# Altium project NumPadAltium.PrjPcb
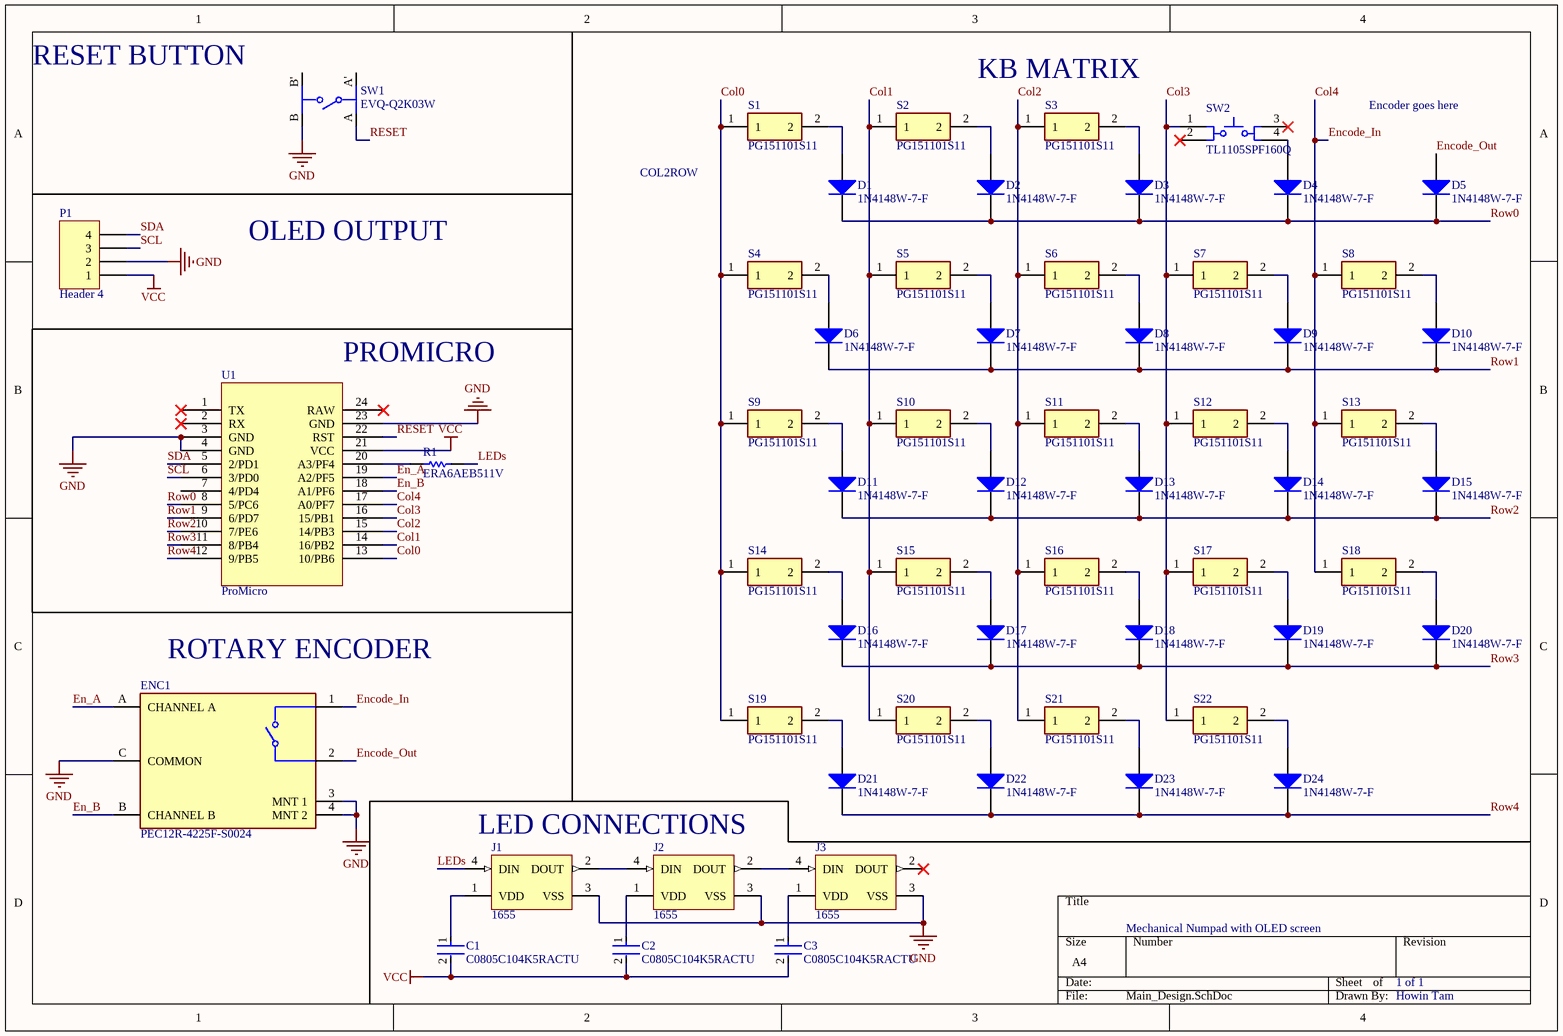
[diagram p0: Main_Design.SchDoc]
1 sheet, 58 parts. Net scope: global (net labels, ports and power ports of the same name join across sheets).
Board file: NumPadPCB.PcbDoc

## Sheet Main_Design.SchDoc
size A4; SheetNumber: 1; SheetTotal: 1

### Parts
C1  C0805C104K5RACTU  [FP-C0805C-DN-MFG]
C2  C0805C104K5RACTU  [FP-C0805C-DN-MFG]
C3  C0805C104K5RACTU  [FP-C0805C-DN-MFG]
D1  1N4148W-7-F  [DIOD-SOD123-2_V]
D2  1N4148W-7-F  [DIOD-SOD123-2_V]
D3  1N4148W-7-F  [DIOD-SOD123-2_V]
D4  1N4148W-7-F  [DIOD-SOD123-2_V]
D5  1N4148W-7-F  [DIOD-SOD123-2_V]
D6  1N4148W-7-F  [DIOD-SOD123-2_V]
D7  1N4148W-7-F  [DIOD-SOD123-2_V]
D8  1N4148W-7-F  [DIOD-SOD123-2_V]
D9  1N4148W-7-F  [DIOD-SOD123-2_V]
D10  1N4148W-7-F  [DIOD-SOD123-2_V]
D11  1N4148W-7-F  [DIOD-SOD123-2_V]
D12  1N4148W-7-F  [DIOD-SOD123-2_V]
D13  1N4148W-7-F  [DIOD-SOD123-2_V]
D14  1N4148W-7-F  [DIOD-SOD123-2_V]
D15  1N4148W-7-F  [DIOD-SOD123-2_V]
D16  1N4148W-7-F  [DIOD-SOD123-2_V]
D17  1N4148W-7-F  [DIOD-SOD123-2_V]
D18  1N4148W-7-F  [DIOD-SOD123-2_V]
D19  1N4148W-7-F  [DIOD-SOD123-2_V]
D20  1N4148W-7-F  [DIOD-SOD123-2_V]
D21  1N4148W-7-F  [DIOD-SOD123-2_V]
D22  1N4148W-7-F  [DIOD-SOD123-2_V]
D23  1N4148W-7-F  [DIOD-SOD123-2_V]
D24  1N4148W-7-F  [DIOD-SOD123-2_V]
ENC1  PEC12R-4225F-S0024  [FP-PEC12R-4225F-S0024-MFG]
J1  1655  [ADA-RGB-1655_V]
J2  1655  [ADA-RGB-1655_V]
J3  1655  [ADA-RGB-1655_V]
P1  Header 4  [HDR1X4]
R1  ERA6AEB511V  [RESC2013X60X40ML20T25]
S1  PG151101S11  [SW_PG151101S11]
S2  PG151101S11  [SW_PG151101S11]
S3  PG151101S11  [SW_PG151101S11]
S4  PG151101S11  [SW_PG151101S11]
S5  PG151101S11  [SW_PG151101S11]
S6  PG151101S11  [SW_PG151101S11]
S7  PG151101S11  [SW_PG151101S11]
S8  PG151101S11  [SW_PG151101S11]
S9  PG151101S11  [SW_PG151101S11]
S10  PG151101S11  [SW_PG151101S11]
S11  PG151101S11  [SW_PG151101S11]
S12  PG151101S11  [SW_PG151101S11]
S13  PG151101S11  [SW_PG151101S11]
S14  PG151101S11  [SW_PG151101S11]
S15  PG151101S11  [SW_PG151101S11]
S16  PG151101S11  [SW_PG151101S11]
S17  PG151101S11  [SW_PG151101S11]
S18  PG151101S11  [SW_PG151101S11]
S19  PG151101S11  [SW_PG151101S11]
S20  PG151101S11  [SW_PG151101S11]
S21  PG151101S11  [SW_PG151101S11]
S22  PG151101S11  [SW_PG151101S11]
SW1  EVQ-Q2K03W  [FP-EVQ-Q2K03W-MFG]
SW2  TL1105SPF160Q  [ESWI-TL1105SPF_V]
U1  ProMicro  [PCBComponent_1]

### Nets
GND: ENC1.3(MNT_1) ENC1.4(MNT_2) ENC1.C(COMMON) J1.3(VSS) J2.3(VSS) J3.3(VSS) P1.2 SW1.B U1.3(GND) U1.4(GND) U1.23(GND)
VCC: C1.2 C2.2 C3.2 P1.1 U1.21(VCC)
Col0: S1.1 S4.1 S9.1 S14.1 S19.1 U1.13(10/PB6)
Col1: S2.1 S5.1 S10.1 S15.1 S20.1 U1.14(16/PB2)
Col2: S3.1 S6.1 S11.1 S16.1 S21.1 U1.15(14/PB3)
Col3: S7.1 S12.1 S17.1 S22.1 SW2.1 U1.16(15/PB1)
Col4: ENC1.1 S8.1 S13.1 S18.1 U1.17(A0/PF7)  [also labelled Encode_In]
En_A: ENC1.A(CHANNEL_A) U1.19(A2/PF5)
En_B: ENC1.B(CHANNEL_B) U1.18(A1/PF6)
Encode_Out: D5.1(A) ENC1.2
LEDs: J1.4(DIN) R1.2
RESET: SW1.A U1.22(RST)
Row0: D1.2(K) D2.2(K) D3.2(K) D4.2(K) D5.2(K) U1.8(5/PC6)
Row1: D6.2(K) D7.2(K) D8.2(K) D9.2(K) D10.2(K) U1.9(6/PD7)
Row2: D11.2(K) D12.2(K) D13.2(K) D14.2(K) D15.2(K) U1.10(7/PE6)
Row3: D16.2(K) D17.2(K) D18.2(K) D19.2(K) D20.2(K) U1.11(8/PB4)
Row4: D21.2(K) D22.2(K) D23.2(K) D24.2(K) U1.12(9/PB5)
SCL: P1.3 U1.6(3/PD0)
SDA: P1.4 U1.5(2/PD1)
NetC1_1: C1.1 J1.1(VDD)
NetC2_1: C2.1 J2.1(VDD)
NetC3_1: C3.1 J3.1(VDD)
NetD1_1: D1.1(A) S1.2
NetD2_1: D2.1(A) S2.2
NetD3_1: D3.1(A) S3.2
NetD4_1: D4.1(A) SW2.4
NetD6_1: D6.1(A) S4.2
NetD7_1: D7.1(A) S5.2
NetD8_1: D8.1(A) S6.2
NetD9_1: D9.1(A) S7.2
NetD10_1: D10.1(A) S8.2
NetD11_1: D11.1(A) S9.2
NetD12_1: D12.1(A) S10.2
NetD13_1: D13.1(A) S11.2
NetD14_1: D14.1(A) S12.2
NetD15_1: D15.1(A) S13.2
NetD16_1: D16.1(A) S14.2
NetD17_1: D17.1(A) S15.2
NetD18_1: D18.1(A) S16.2
NetD19_1: D19.1(A) S17.2
NetD20_1: D20.1(A) S18.2
NetD21_1: D21.1(A) S19.2
NetD22_1: D22.1(A) S20.2
NetD23_1: D23.1(A) S21.2
NetD24_1: D24.1(A) S22.2
NetJ1_2: J1.2(DOUT) J2.4(DIN)
NetJ2_2: J2.2(DOUT) J3.4(DIN)
NetR1_1: R1.1 U1.20(A3/PF4)

Not connected (* = marked no-connect by the designer): J3 2(DOUT)*; SW1 A' B'; SW2 2* 3*; U1 1(TX)* 2(RX)* 7(4/PD4) 24(RAW)*

### Notes on the sheet
- RESET BUTTON
- KB MATRIX
- Encoder goes here
- COL2ROW
- OLED OUTPUT
- (near U1) PROMICRO
- (near ENC1) ROTARY ENCODER
- LED CONNECTIONS
- Mechanical Numpad with OLED screen
- 1 of 1
- Howin Tam

### Library data of the parts
C1-C3 = CMP-2007-00279-2: CAP CER 0.1UF 50V X7R 0805; Manufacturer: KEMET; Value: 0.10 μF; Tolerance: 0.1; Temperature Coefficient: 30ppm/°C; Material: Ceramic; Manufacturer Part Number: C0805C104K5RACTU; Device Class L2: Capacitors; Temperature Range Low: -55°C; Voltage Rating: 50 V; Digikey Description: CAP CER 0.1UF 50V X7R 0805; Category: Cap; ComponentLink2Description: Datasheet; Octopart: https://octopart.com/c0805c104k5ractu-kemet-143926; RoHS: TRUE; ComponentLink2URL: https://content.kemet.com/datasheets/KEM_C1003_C0G_SMD.pdf; Temperature Characteristic: X7R; Temperature: -55°C to +125°C; Height: 0.88mm; Temperature Range High: +125°C; Device Class L1: Passive Components; Automotive: No; Lead Free: Yes; Ipc Land Pattern Name: CAPC200125X78; Device Class L3: Ceramic Capacitors; Mouser Description: Cap Ceramic 0.1uF 50V X7R 10% SMD 2.0 x 1.2 mm 125 C Paper T/R; Capacitance: 0.10 μF; Package: C0805C-DN
D1-D24 = CMP-2000-04932-2: Fast Switching Diode, 100 V, 0.15 A, -65 to 150 degC, 2-Pin?SOD123, RoHS, Tape and Reel; Recovery Time: 4ns; Brand: DiodesIncorporated; Unit Weight: 0.000353oz; Max Surge Current: 2A; Peak Reverse Voltage: 100V; Ir - Reverse Current: 1uA; Vf - Forward Voltage: 1.25V; Configuration: Single; If - Forward Current: 0.15A; Product Category: Diodes-GeneralPurpose,Power,Switching; Operating Temperature Range: -65Cto+150C; Packaging: Reel; Manufacturer URL: http://www.diodes.com/; Maximum Operating Temperature: +150C; Height: 1.25mm; Minimum Operating Temperature: -65C; Product: SwitchingDiodes; Package URL: http://www.diodes.com/datasheets/ds18004.pdf; Type: SwitchingDiode; Package Reference: SOD123-2; Width: 1.7mm; Datasheet URL: http://www.farnell.com/datasheets/1915529.pdf; Datasheet Version: Rev. 24-2, 10/2013; Series: 1N4148; Factory Pack Quantity: 3000; Length: 2.85mm; RoHS: True; Manufacturer: DiodesIncorporated; Mounting Style: SMD/SMT; Package / Case: SOD-123
ENC1 = CMP-07421-000041-1: ROTARY ENCODER MECHANICAL 24PPR; Built in Switch: Yes; Hole Diameter: 1mm; Number of Channels: 2; Pulses per Revolution: 24; Output Type: Quadrature; Height: 13.4mm; Mount: Through Hole; RoHS Compliant: Yes; Orientation: Vertical; Length: 13.4mm; Encoder Type: Mechanical; Termination: PC Pin; Series: PEC12R; Min Operating Temperature: -30°C; Detent: Yes; REACH SVHC: No SVHC; Package Quantity: 75; Max Operating Temperature: 70°C; Packaging: Bulk; Width: 12.5mm
J1-J3 = CMP-2000-05026-1: Intelligent Control LED Integrated Light Source, 3.5 to 5.3 V, -25 to 80 degC, 4-Pin SMD, RoHS, Tape and Reel; Manufacturer: Adafruit-Industries-LLC; Number of LEDs: 10; Configuration: Discrete; Utilized LED: WS2812(5050); Datasheet URL: http://datasheet.octopart.com/ADA1655-Adafruit-Industries-datasheet-32028139.pdf; Series: Neopixel; Interface: -; Package Description: 4-Pin Surface Mount Device, Body 5 x 5 mm; Color: Red,Green,Blue(RGB); Category: Optoelectronics; Controller Type: -; Package Reference: 1655; Manufacturer URL: https://www.adafruit.com/; Mounting Type: SurfaceMount; Datasheet Version: May-13; Size / Dimension: 5.00mmLx5.00mmW; Family: Addressable,Specialty
P1 = Header 4: Header, 4-Pin; LatestRevisionDate: 17-Jul-2002; LatestRevisionNote: Re-released for DXP Platform.; Publisher: Altium Limited
R1 = CMP-2001-00648-1: Manufacturer: Panasonic; Part Number: ERA6AEB511V
S1-S22 = PG151101S11: Keyswitch; MF: Kailh; SnapEDA_Link: https://www.snapeda.com/parts/PG151101S11/Kailh/view-part/4218555/?ref=snap; Price: None; MP: PG151101S11; Availability: Unavailable; Value: *; Package: Package
SW1 = CMP-05618-000015-1: SWITCH TACTILE SPST-NO 0.02A 15V; Manufacturer: Panasonic Electronic Components; Contact Resistance: 100mΩ; Electromechanical Life: 1000000Cycles; Contact Current Rating: 20mA; Operating Force: 1.3N; Mount: Surface Mount; Mouser Description: Tactile Switches 1.3NF 6.5x6.0x3.1mm; Device Class L2: Switches; RoHS: TRUE; Lead Free: Yes; Temperature Range Low: -40°C; Height: 3.3mm; Automotive: No; Device Class L3: Tactile Switches; Manufacturer Part Number: EVQ-Q2K03W; ComponentLink2URL: https://industrial.panasonic.com/cdbs/www-data/pdf/ATK0000/ATK0000C360.pdf; Throw Configuration: SPST-NO; Temperature: -40°C to +85°C; ComponentLink2Description: Datasheet; Device Class L1: Electromechanical; Voltage Rating Dc: 15V; Package: 0; Temperature Range High: +85°C; Octopart: https://octopart.com/evq-q2k03w-panasonic-1224370; Category: Switch; Digikey Description: SWITCH TACTILE SPST-NO 0.02A 15V
SW2 = CMP-2000-07248-1: Tact Switch, SPST-NO, 50 mA, 12 VDC, -20 to 70 degC, 4-Pin THD, RoHS, Bulk; Manufacturer: E-Switch; Actuation Force: 1.6N; Actuator Style: RoundButton; Package URL: http://spec_sheets.e-switch.com/specs/P010201.pdf; Contact Material: Silver; Size: 6x6mm; Manufacturer URL: http://www.e-switch.ch/en/; Datasheet Version: 12/2013; Package Description: 4-Pin Through Hole Device, Body 6 x 6 mm; Datasheet URL: https://www.e-switch.com/system/asset/product_line/data_sheet/140/TL1105.pdf; Termination Style: RightAngle; Package Reference: TL1105SPF; Mounting Technology: ThroughHole
U1 = Component_1